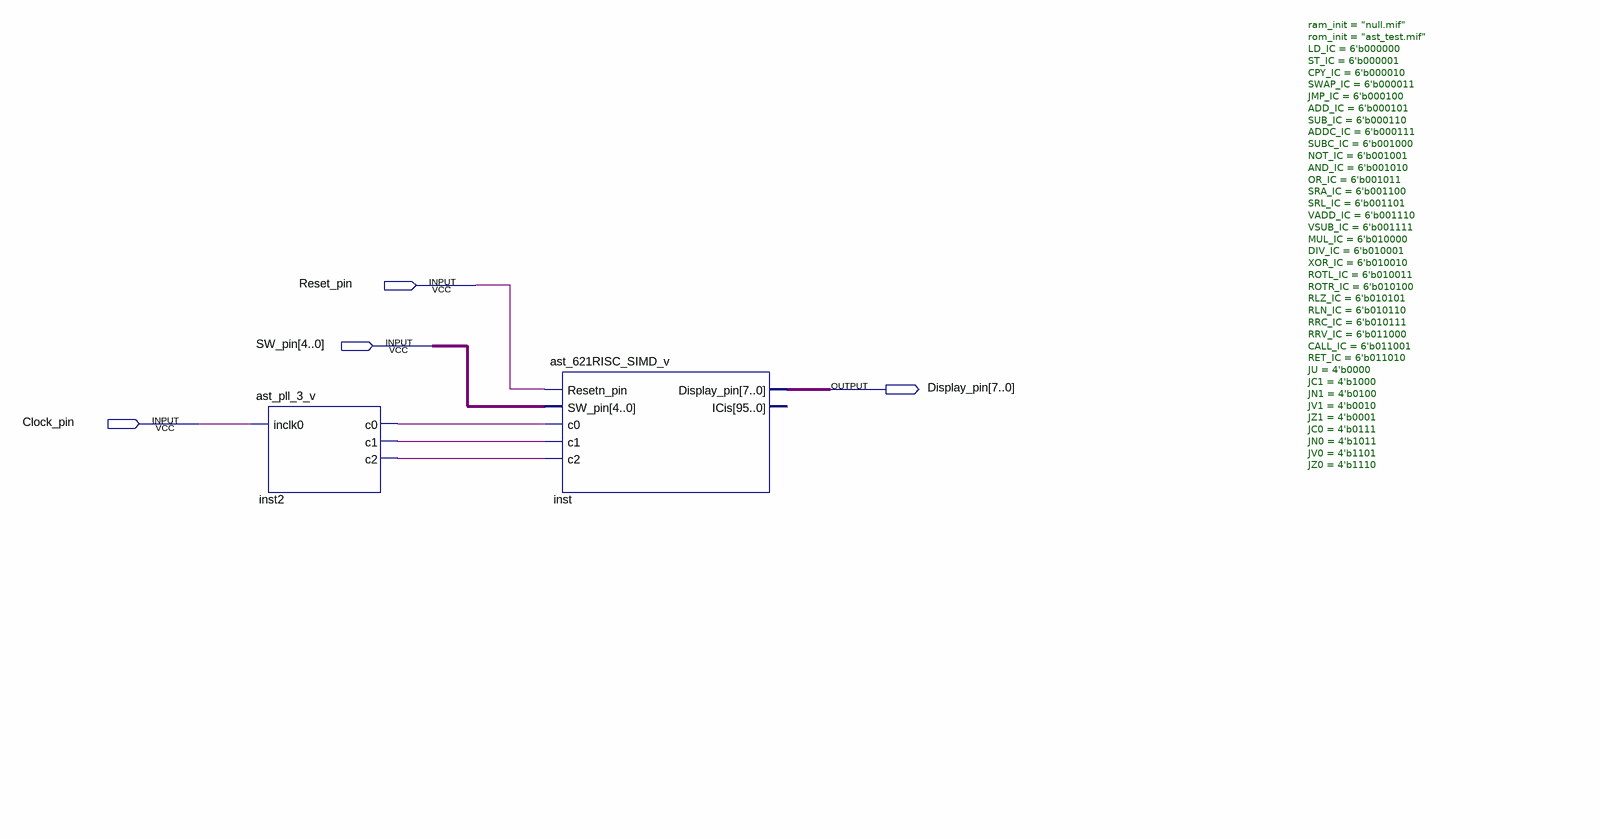
[diagram p0: schematic sheet]
// Quartus schematic ast_lab11_top.bdf as structural Verilog: 2 symbols, 4 pins
module ast_lab11_top (
  input  Reset_pin,
  input  [4:0] SW_pin,
  input  Clock_pin,
  output [7:0] Display_pin
);

  wire inst2_c0, inst2_c1, inst2_c2;

  ast_pll_3_v inst2 (.inclk0(Clock_pin), .c0(inst2_c0), .c1(inst2_c1), .c2(inst2_c2));
  ast_621RISC_SIMD_v #(.ram_init("null.mif"), .rom_init("ast_test.mif"), .LD_IC(6'b000000), .ST_IC(6'b000001), .CPY_IC(6'b000010), .SWAP_IC(6'b000011), .JMP_IC(6'b000100), .ADD_IC(6'b000101), .SUB_IC(6'b000110), .ADDC_IC(6'b000111), .SUBC_IC(6'b001000), .NOT_IC(6'b001001), .AND_IC(6'b001010), .OR_IC(6'b001011), .SRA_IC(6'b001100), .SRL_IC(6'b001101), .VADD_IC(6'b001110), .VSUB_IC(6'b001111), .MUL_IC(6'b010000), .DIV_IC(6'b010001), .XOR_IC(6'b010010), .ROTL_IC(6'b010011), .ROTR_IC(6'b010100), .RLZ_IC(6'b010101), .RLN_IC(6'b010110), .RRC_IC(6'b010111), .RRV_IC(6'b011000), .CALL_IC(6'b011001), .RET_IC(6'b011010), .JU(4'b0000), .JC1(4'b1000), .JN1(4'b0100), .JV1(4'b0010), .JZ1(4'b0001), .JC0(4'b0111), .JN0(4'b1011), .JV0(4'b1101), .JZ0(4'b1110)) inst (
    .Resetn_pin(Reset_pin), .SW_pin(SW_pin), .c0(inst2_c0), .c1(inst2_c1), .c2(inst2_c2),
    .Display_pin(Display_pin));  // open: ICis
endmodule
